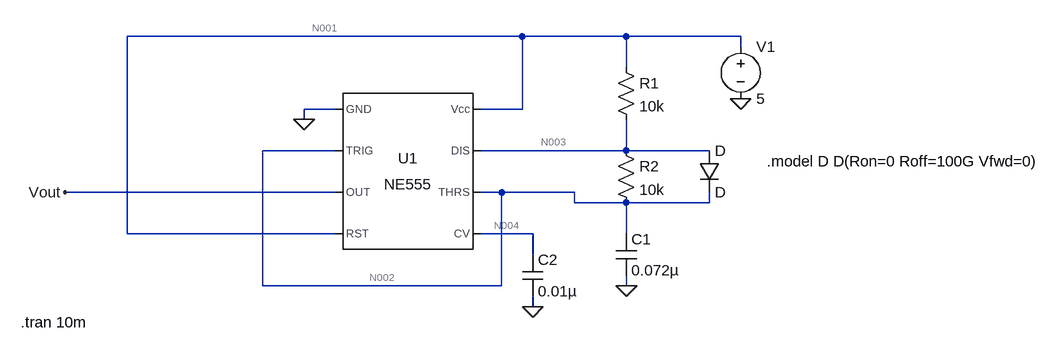
[diagram p0: schematic Symmetrical.asc]
Symmetrical.asc, the LTspice schematic file:
Version 4
SHEET 1 1364 680
WIRE 400 -64 -208 -64
WIRE 560 -64 400 -64
WIRE 736 -64 560 -64
WIRE 736 -48 736 -64
WIRE 560 -16 560 -64
WIRE 112 48 64 48
WIRE 400 48 400 -64
WIRE 400 48 336 48
WIRE 64 64 64 48
WIRE 112 112 0 112
WIRE 560 112 560 64
WIRE 560 112 336 112
WIRE 688 112 560 112
WIRE 112 176 -304 176
WIRE 368 176 336 176
WIRE 480 176 368 176
WIRE 480 192 480 176
WIRE 560 192 480 192
WIRE 688 192 688 176
WIRE 688 192 560 192
WIRE -208 240 -208 -64
WIRE 112 240 -208 240
WIRE 416 240 336 240
WIRE 560 240 560 192
WIRE 416 272 416 240
WIRE 0 320 0 112
WIRE 368 320 368 176
WIRE 368 320 0 320
WIRE 560 320 560 304
WIRE 416 352 416 336
FLAG 416 352 0
FLAG 560 320 0
FLAG 736 32 0
FLAG 64 64 0
FLAG -304 176 Vout
SYMBOL Misc\\NE555 224 144 R0
SYMATTR InstName U1
SYMBOL voltage 736 -64 R0
WINDOW 123 0 0 Left 0
WINDOW 39 0 0 Left 0
SYMATTR InstName V1
SYMATTR Value 5
SYMBOL res 544 -32 R0
SYMATTR InstName R1
SYMATTR Value 10k
SYMBOL res 544 96 R0
SYMATTR InstName R2
SYMATTR Value 10k
SYMBOL cap 544 240 R0
SYMATTR InstName C1
SYMATTR Value 0.072µ
SYMBOL cap 400 272 R0
SYMATTR InstName C2
SYMATTR Value 0.01µ
SYMBOL diode 672 112 R0
SYMATTR InstName D
TEXT -372 376 Left 2 !.tran 10m
TEXT 776 128 Left 2 !.model D D(Ron=0 Roff=100G Vfwd=0)

The netlist it stands for:
* Symmetrical.asc
XU1 0 N002 Vout N001 N004 N002 N003 N001 NE555  ; pins GND TRIG OUT RST CV THRS DIS Vcc
V1 N001 0 5
R1 N001 N003 10k
R2 N003 N002 10k
C1 N002 0 0.072µ
C2 N004 0 0.01µ
D N003 N002 D
.model D D
.lib standard.dio
.tran 10m
.model D D(Ron=0 Roff=100G Vfwd=0)
.lib NE555.sub
.backanno
.end

* Results of the author's LTspice run, read from the files saved beside the schematic
* Operating Point, zero values left out:
*   V(n002) = 5 V
*   V(n004) = 3.333 V
*   V(n001) = 5 V
*   V(n003) = 5 V
*   V(vout) = 5 V
*   I(D) = 9.999 nA
*   I(R1) = 16.67 nA
*   I(V1) = -1.611 mA
*   Ix(u1:1) = -1.611 mA
*   Ix(u1:2) = 5 nA
*   Ix(u1:4) = 22.67 µA
*   Ix(u1:6) = 5 nA
*   Ix(u1:7) = 6.671 nA
*   Ix(u1:8) = 1.588 mA
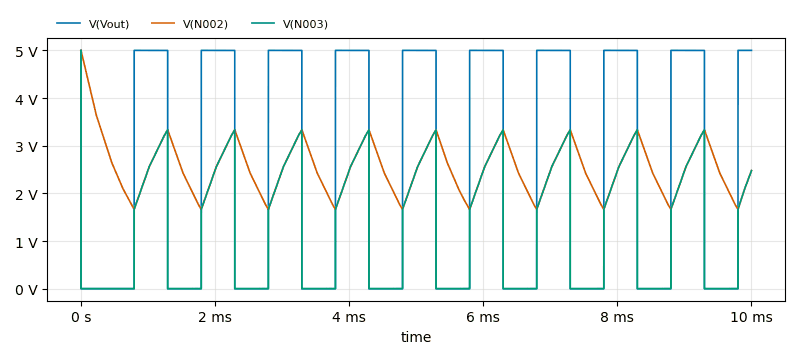
[diagram p1: Transient Analysis of Symmetrical.asc, plotted from the saved traces]
* Transient Analysis, 1 run:
*   V(Vout): min 30 µV, max 5 V, average 2.35 V, rms 3.428 V, last 5 V
*   V(N002): min 1.666 V, max 5 V, average 2.536 V, rms 2.616 V, last 2.478 V
*   V(N003): min 3.995 mV, max 5 V, average 1.204 V, rms 1.796 V, last 2.478 V